# EAGLE design tx_btns (EAGLE 9.4.2)
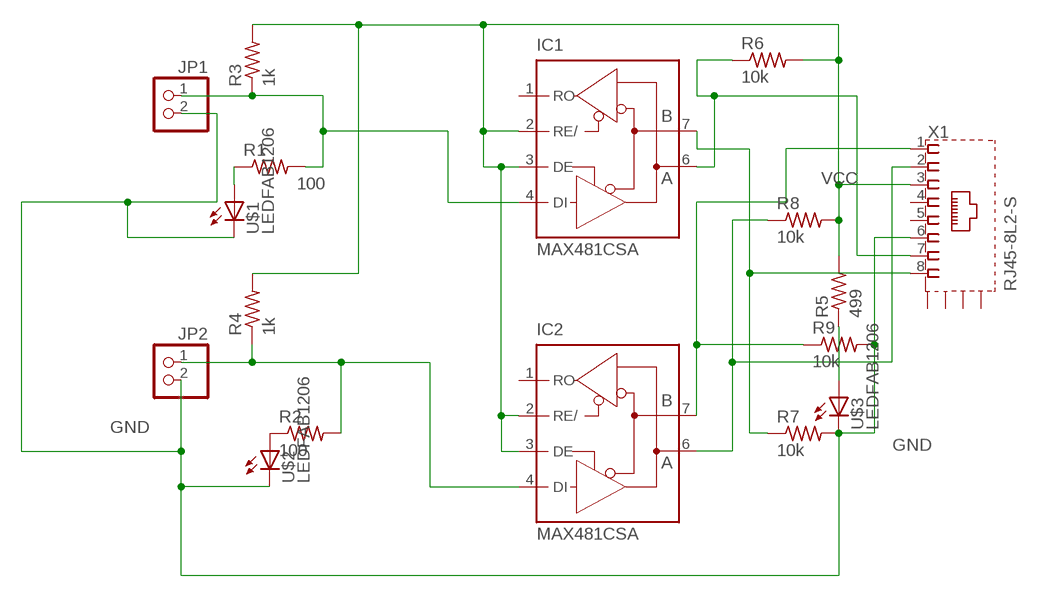
[diagram p0: schematic, sheet 1]

## Parts
IC1  MAX481CSA  [SO08]
IC2  MAX481CSA  [SO08]
JP1  PINHD-1X2/90  [1X02/90]
JP2  PINHD-1X2/90  [1X02/90]
R1  100  RES-US1206FAB  [R1206FAB]
R2  100  RES-US1206FAB  [R1206FAB]
R3  1k  RES-US1206FAB  [R1206FAB]
R4  1k  RES-US1206FAB  [R1206FAB]
R5  499  RES-US1206FAB  [R1206FAB]
R6  10k  RES-US1206FAB  [R1206FAB]
R7  10k  RES-US1206FAB  [R1206FAB]
R8  10k  RES-US1206FAB  [R1206FAB]
R9  10k  RES-US1206FAB  [R1206FAB]
U$1  LEDFAB1206  [LED1206FAB]
U$2  LEDFAB1206  [LED1206FAB]
U$3  LEDFAB1206  [LED1206FAB]
X1  RJ45-8L2-S  [RJ45-SHIELD2]

## Nets
GND: JP1.2 JP2.2 R7.2 R9.2 U$1.2(C) U$2.2(C) U$3.2(C) X1.6
N$1: R1.1 U$1.1(A)
N$2: R2.1 U$2.1(A)
N$3: R5.1 U$3.1(A)
N$5: IC1.4(DI) JP1.1 R1.2 R3.1
N$6: IC1.7(B) R7.1 X1.8
N$8: IC2.6(A) R8.1 X1.2
N$9: IC1.6(A) R6.1 X1.7
N$10: IC2.7(B) R9.1 X1.1
N$12: IC2.4(DI) JP2.1 R2.2 R4.1
VCC: IC1.2(RE/) IC1.3(DE) IC2.2(RE/) IC2.3(DE) R3.2 R4.2 R5.2 R6.2 R8.2 X1.3
Unconnected: IC1.1(RO) IC2.1(RO) X1.4 X1.5 X1.S1(S) X1.S2(S) X1.S3(S) X1.S4(S)

## Power pins joined to a net without a drawn wire
GND: IC1.5(GND) IC2.5(GND)
VCC: IC1.8(VCC) IC2.8(VCC)

## Library data of the parts
IC1 IC2 = maxim:MAX481CSA: RS485 TRANSEIVER; MF: MAXIM; MPN: MAX481CSA; OC_FARNELL: unknown; OC_NEWARK: 90C3817
JP1 JP2 = pinhead:PINHD-1X2: PIN HEADER
R1-R9 = fab:RES-US: Resistor (US Symbol) Variants with postfix FAB are widened to allow the routing of internal traces
U$1-U$3 = fab:LED: LED
X1 = con-tycoelectronics:RJ45*2: RJ45 Low Profile Shield Type 2 For all RJ45 L, LC, LCT and X Series Models Source: www.tycoelectronics.com .. ENG_DS_1654001_1099_RJ_L_0507.pdf; MF: TYCO ELECTRONICS; MPN: RJ45-8L2-S; OC_FARNELL: unknown; OC_NEWARK: 52K4446

## Board
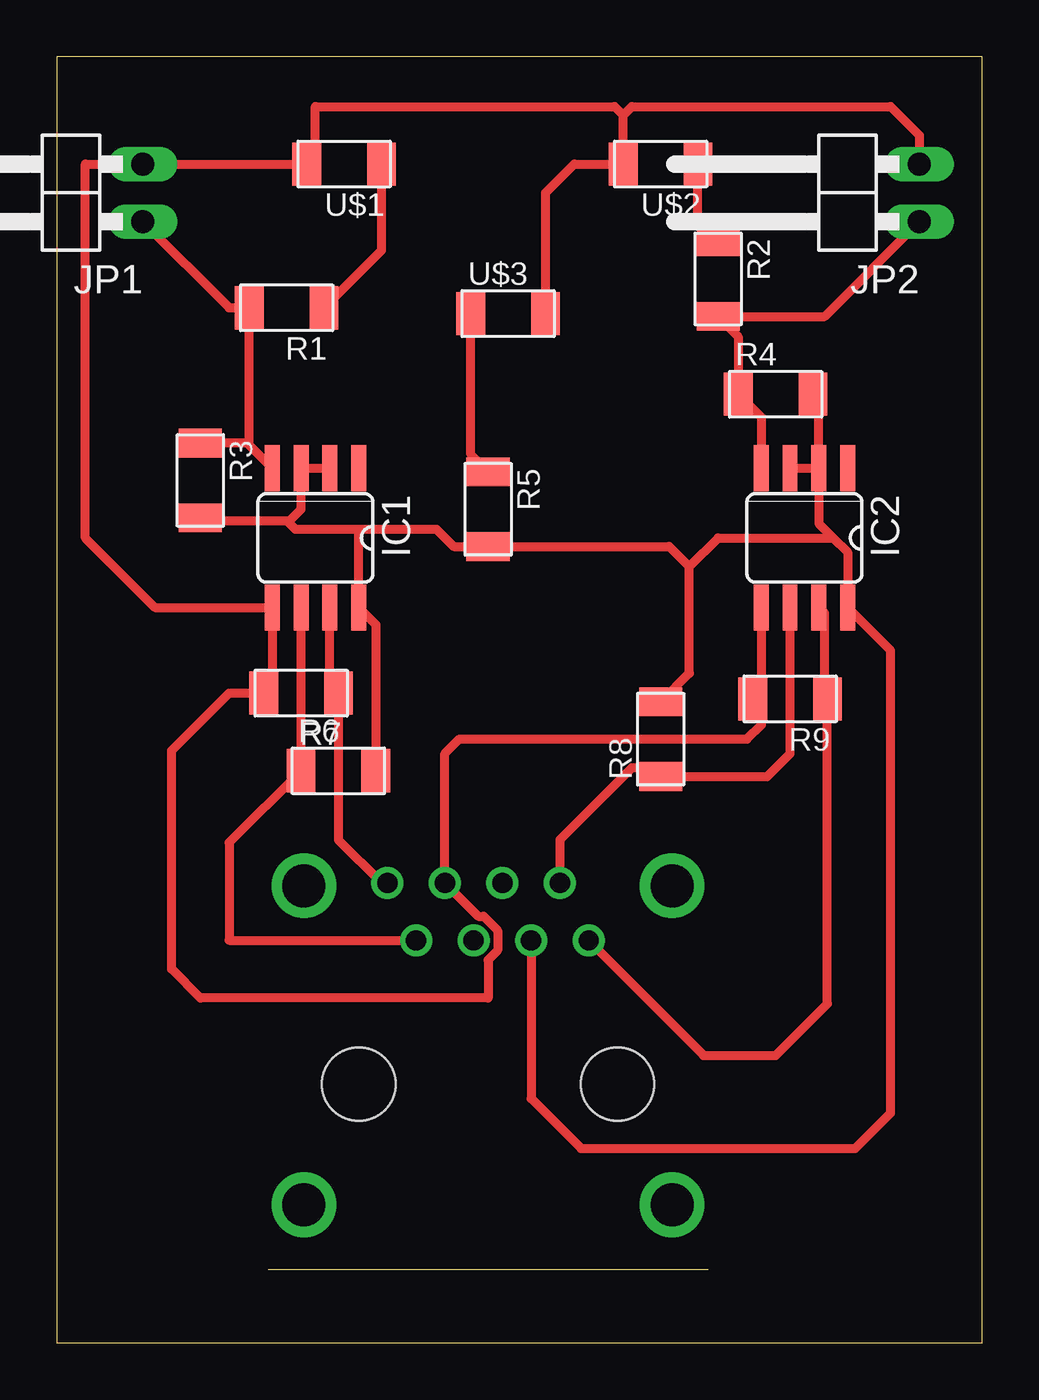
[diagram p1: board, top side]
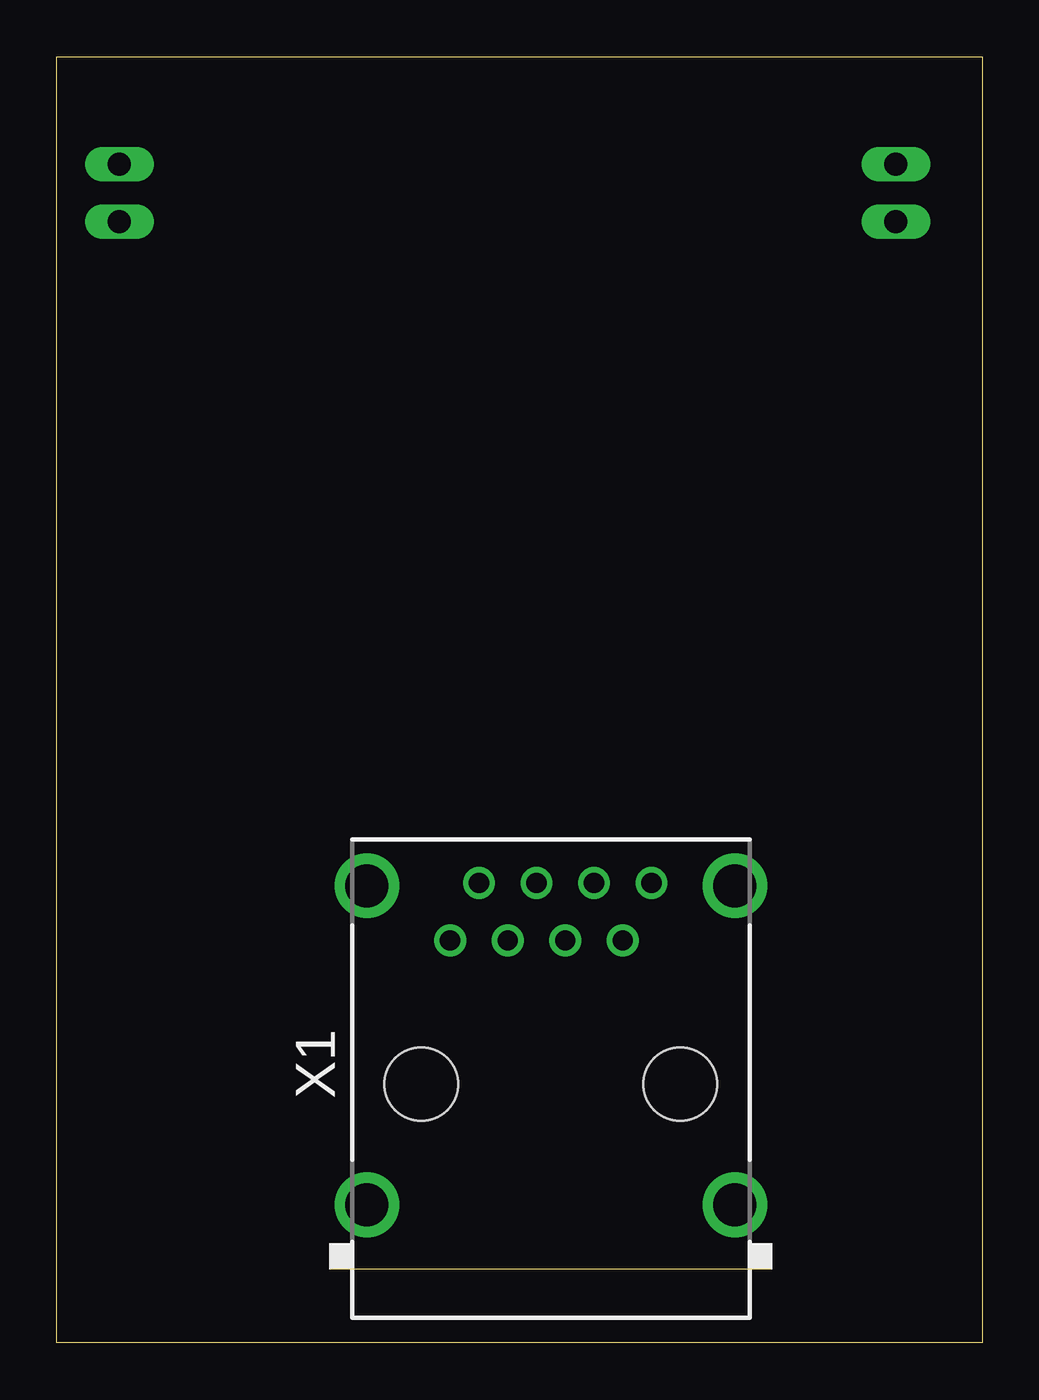
[diagram p2: board, bottom side, seen from below]

Size 40.87 x 56.82 mm. Coordinates in mm from the lower left corner, seen from the top.
Outline: 0,0 40.87,0 40.87,56.82 0,56.82 0,0
Copper layers (1*16): Top 0.035mm / dielectric 1.5mm / Bottom 0.035mm
Design rules "default": minimum track width 6mil, minimum drill 0.35mm, track to track 6mil, track to pad 6mil, pad to pad 6mil, via to via 6mil, smd to smd 6mil, copper to edge 40mil, drill to drill 6mil, minimum pad ring 10mil, minimum via ring 8mil, stop-mask expansion 4mil, vias tented up to drill 0mil, thermal gap 10mil

### Footprints (pad centres in the part's own frame; a part is rotated, then mirrored left to right if it is on the bottom)
SO08 = smd 0.66 x 2.032: 1 -1.905,-3.073; 2 -0.635,-3.073; 3 0.635,-3.073; 4 1.905,-3.073; 5 1.905,3.073; 6 0.635,3.073; 7 -0.635,3.073; 8 -1.905,3.073
1X02/90 = drill 1.016 long: 1 -1.27,-3.81; 2 1.27,-3.81
R1206FAB = smd 1.27 x 1.905: 1 -1.651,0; 2 1.651,0
LED1206FAB = smd 1.27 x 1.905: 1 -1.651,0; 2 1.651,0
RJ45-SHIELD2 = drill 0.9 pad 1.4: 1 -4.445,6.35; 2 -3.175,8.89; 3 -1.905,6.35; 4 -0.635,8.89; 5 0.635,6.35; 6 1.905,8.89; 7 3.175,6.35; 8 4.445,8.89 | drill 1.9 pad 2.5: S1 -8.128,-5.33; S2 8.128,-5.33; S3 -8.128,8.76; S4 8.128,8.76 | hole 3.251: -5.715,0; 5.715,0

### Placement (x,y rotation side)
IC1  11.43,35.56 180 top
IC2  33.02,35.56 180 top
JP1  0,50.8 90 top
JP2  34.29,50.8 90 top
R1  10.16,45.72 180 top
R2  29.21,46.99 270 top
R3  6.35,38.1 270 top
R4  31.75,41.91 0 top
R5  19.05,36.83 270 top
R6  12.45,25.27 0 top
R7  10.79,28.7 180 top
R8  26.67,26.67 90 top
R9  32.38,28.45 180 top
U$1  12.7,52.07 180 top
U$2  26.67,52.07 180 top
U$3  19.94,45.47 0 top
X1  19.05,11.43 0 bottom

### Tracks (layer width: path | path; a pad name or v marks a point on that pad's centre or on a via)
GND
  Top 0.406: U$3.2 21.59,50.8 22.86,52.07 U$2.2 25.02,54.23 | 25.02,54.23 25.4,54.61 36.83,54.61 38.1,53.34 JP2.2 | 25.02,54.23 24.64,54.61 11.43,54.61 11.43,52.45 U$1.2 JP1.2 1.27,52.07 1.27,35.56 4.34,32.49 IC1.5 9.53,29.08 R7.2 7.62,28.7 5.08,26.16 5.08,16.51 6.35,15.24 19.05,15.24 19.05,16.92 19.48,17.34 19.48,18.22 18.85,18.84 18.62,18.84 X1.6 17.14,26.04 17.78,26.67 30.48,26.67 31.11,27.3 31.11,28.07 | IC2.5 31.11,28.07 | R9.2 31.11,28.07
N$1
  Top 0.406: R1.1 14.35,48.26 U$1.1
N$2
  Top 0.406: R2.1 28.32,49.53 U$2.1
N$3
  Top 0.406: R5.1 18.29,39.24 U$3.1
N$5
  Top 0.406: R3.1 8.41,39.75 IC1.4 8.51,39.65 R1.2 7.62,45.72 JP1.1
N$6
  Top 0.406: 12.57,28.57 R7.1 | R7.1 12.06,29.08 IC1.7 | X1.8 14.35,20.32 12.45,22.23 R7.1
N$8
  Top 0.406: IC2.6 32.38,26.04 31.37,25.02 R8.1 26.29,25.4 25.4,25.4 22.23,22.23 X1.2
N$9
  Top 0.406: IC1.6 R6.1 7.62,22.1 7.62,17.78 X1.7
N$10
  Top 0.406: IC2.7 33.91,32.23 33.91,28.45 R9.1 34.04,14.99 31.75,12.7 28.57,12.7 X1.1
N$12
  Top 0.406: IC2.4 31.11,40.89 R4.1 30.1,44.45 R2.2 33.91,45.34 JP2.1
VCC
  Top 0.406: R3.2 6.48,36.32 10.16,36.32 | 10.16,36.32 10.29,36.32 10.79,36.83 IC1.3 IC1.2 | 10.16,36.32 10.54,35.94 11.43,35.94 13.34,35.94 | 18.67,35.56 R5.2 | IC2.3 IC2.2 | IC2.2 33.66,41.66 R4.2 | IC2.2 33.66,36.2 34.29,35.56 | 34.29,35.56 34.92,34.92 IC2.8 36.83,30.58 36.83,10.16 35.26,8.59 23.16,8.59 20.95,10.79 X1.3 | R8.2 27.94,29.59 27.94,34.29 | 27.94,34.29 29.21,35.56 34.29,35.56 | R6.2 14.1,31.73 IC1.8 13.34,35.94 | R5.2 27.05,35.18 27.94,34.29 | 13.34,35.94 16.76,35.94 17.53,35.18 R5.2